# EAGLE schematic MotorController (EAGLE 7.5.0)
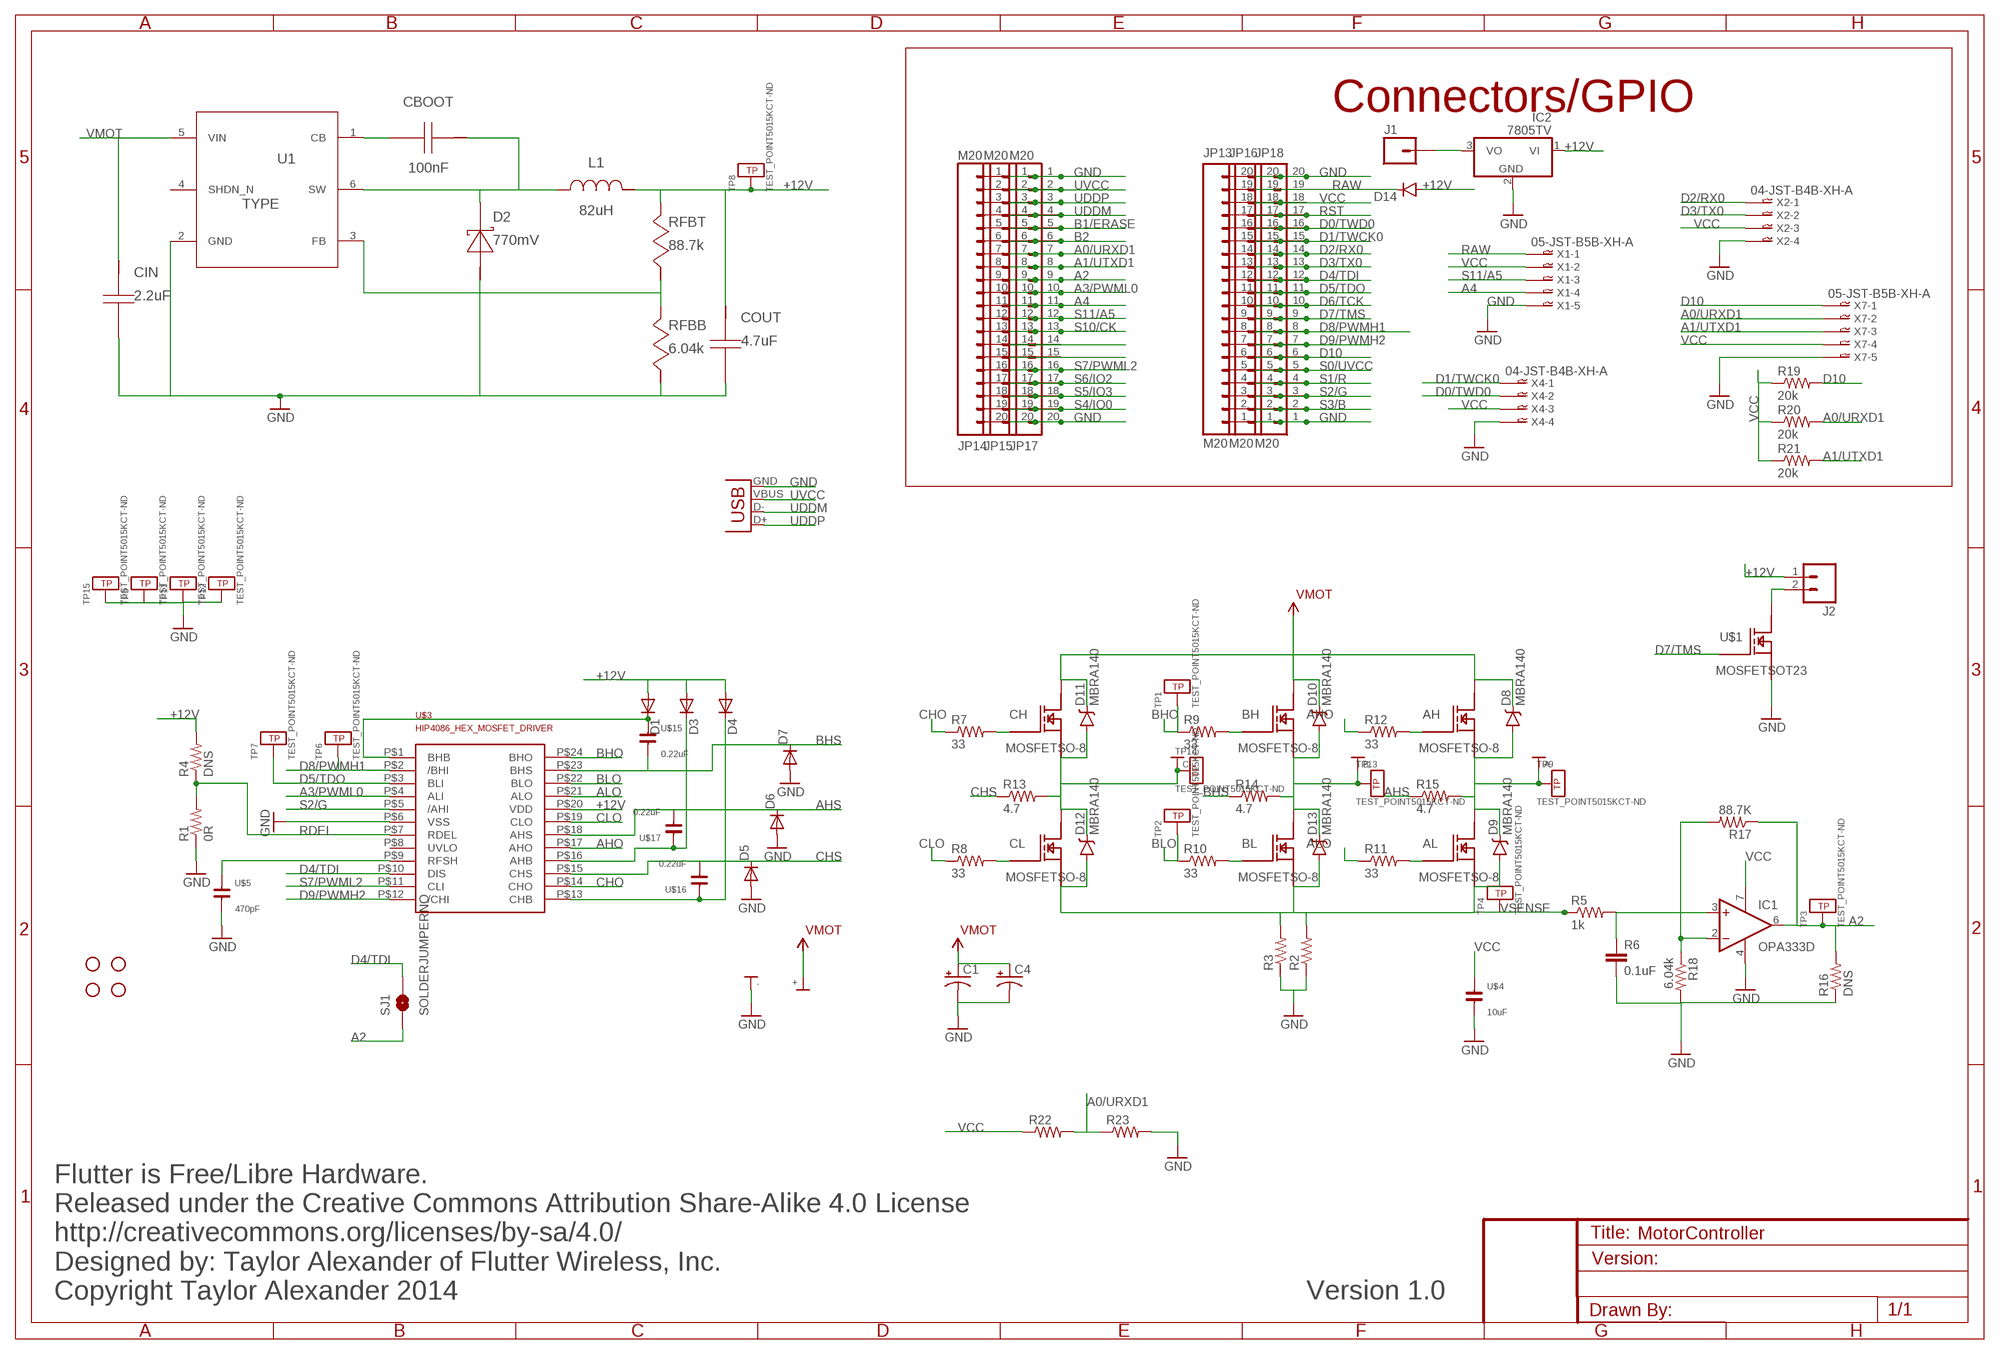
[diagram p0: schematic, sheet 1]

## Parts
+  HIGHCURRENTPAD2  [HIGH_CURRENT_PAD2]
-  HIGHCURRENTPAD2  [HIGH_CURRENT_PAD2]
A  HIGHCURRENTPAD2  [HIGH_CURRENT_PAD2]
AH  MOSFETSO-8  [POWERPAK_S0-8]
AL  MOSFETSO-8  [POWERPAK_S0-8]
B  HIGHCURRENTPAD2  [HIGH_CURRENT_PAD2]
BH  MOSFETSO-8  [POWERPAK_S0-8]
BL  MOSFETSO-8  [POWERPAK_S0-8]
C  HIGHCURRENTPAD2  [HIGH_CURRENT_PAD2]
C1  CAPACITOR-POLARIZED  [CAP-6.5X18MM]
C4  CAPACITOR-POLARIZED  [CAP-6.5X18MM]
CBOOT  100nF  GRM188R72A104KA35D  [0603]
CH  MOSFETSO-8  [POWERPAK_S0-8]
CIN  2.2uF  C3225X7R2A225K230AB  [1210]
CL  MOSFETSO-8  [POWERPAK_S0-8]
COUT  4.7uF  GRM21BR61E475MA12L  [0805]
D1  DIODESMA  [SMA-DIODE]
D2  770mV  DFLS1100-7  [POWERDI123]
D3  DIODESMA  [SMA-DIODE]
D4  DIODESMA  [SMA-DIODE]
D5  DIODESMA  [SMA-DIODE]
D6  DIODESMA  [SMA-DIODE]
D7  DIODESMA  [SMA-DIODE]
D8  MBRA140  DIODE-SCHOTTKY-MBRA140  [SMA-DIODE]
D9  MBRA140  DIODE-SCHOTTKY-MBRA140  [SMA-DIODE]
D10  MBRA140  DIODE-SCHOTTKY-MBRA140  [SMA-DIODE]
D11  MBRA140  DIODE-SCHOTTKY-MBRA140  [SMA-DIODE]
D12  MBRA140  DIODE-SCHOTTKY-MBRA140  [SMA-DIODE]
D13  MBRA140  DIODE-SCHOTTKY-MBRA140  [SMA-DIODE]
D14  DIODESOD123  [SOD-123]
IC1  OPA333D  [SO08]
IC2  7805TV  [TO220V]
J1  M01PTH  [1X01]
J2  M02PTH  [1X02]
JP13  M20  [1X20]
JP14  M20  [1X20]
JP15  M20  [1X20]
JP16  M20  [1X20]
JP17  M20  [1X20]
JP18  M20  [1X20]
L1  82uH  ME3220-823KLB  [ME3220]
R1  0R  RESISTOR0603  [0603-RES]
R2  RESISTOROHMITE  [OHMITE_FCSL64_CURRENT_SENSE_RESISTOR]
R3  RESISTOROHMITE  [OHMITE_FCSL64_CURRENT_SENSE_RESISTOR]
R4  DNS  RESISTOR0603  [0603-RES]
R5  1k  RESISTOR0603  [0603-RES]
R6  0.1uF  CAP0805  [0805]
R7  33  RESISTOR0402  [0402-RES]
R8  33  RESISTOR0402  [0402-RES]
R9  33  RESISTOR0402  [0402-RES]
R10  33  RESISTOR0402  [0402-RES]
R11  33  RESISTOR0402  [0402-RES]
R12  33  RESISTOR0402  [0402-RES]
R13  4.7  RESISTOR0402  [0402-RES]
R14  4.7  RESISTOR0402  [0402-RES]
R15  4.7  RESISTOR0402  [0402-RES]
R16  DNS  RESISTOR0402  [0402-RES]
R17  88.7K  RESISTOR0402  [0402-RES]
R18  6.04k  RESISTOR0402  [0402-RES]
R19  20k  RESISTOR0402  [0402-RES]
R20  20k  RESISTOR0402  [0402-RES]
R21  20k  RESISTOR0402  [0402-RES]
R22  RESISTOR0603  [0603-RES]
R23  RESISTOR0603  [0603-RES]
RFBB  6.04k  CRCW04026K04FKED  [0402]
RFBT  88.7k  CRCW040288K7FKED  [0402]
SJ1  SOLDERJUMPERNO  [SJ_2S-NO]
STANDOFF1  STAND-OFF  [STAND-OFF]
STANDOFF2  STAND-OFF  [STAND-OFF]
STANDOFF3  STAND-OFF  [STAND-OFF]
STANDOFF4  STAND-OFF  [STAND-OFF]
TP1  TEST_POINT5015KCT-ND  [TEST_POINT_SMT_KEYSTONE_5015]
TP2  TEST_POINT5015KCT-ND  [TEST_POINT_SMT_KEYSTONE_5015]
TP3  TEST_POINT5015KCT-ND  [TEST_POINT_SMT_KEYSTONE_5015]
TP4  TEST_POINT5015KCT-ND  [TEST_POINT_SMT_KEYSTONE_5015]
TP5  TEST_POINT5015KCT-ND  [TEST_POINT_SMT_KEYSTONE_5015]
TP6  TEST_POINT5015KCT-ND  [TEST_POINT_SMT_KEYSTONE_5015]
TP7  TEST_POINT5015KCT-ND  [TEST_POINT_SMT_KEYSTONE_5015]
TP8  TEST_POINT5015KCT-ND  [TEST_POINT_SMT_KEYSTONE_5015]
TP9  TEST_POINT5015KCT-ND  [TEST_POINT_SMT_KEYSTONE_5015]
TP11  TEST_POINT5015KCT-ND  [TEST_POINT_SMT_KEYSTONE_5015]
TP12  TEST_POINT5015KCT-ND  [TEST_POINT_SMT_KEYSTONE_5015]
TP13  TEST_POINT5015KCT-ND  [TEST_POINT_SMT_KEYSTONE_5015]
TP14  TEST_POINT5015KCT-ND  [TEST_POINT_SMT_KEYSTONE_5015]
TP15  TEST_POINT5015KCT-ND  [TEST_POINT_SMT_KEYSTONE_5015]
U1  Value  LMR16006YDDCR  [DDC0006A]
U$1  MOSFETSOT23  [SOT23]
U$3  HIP4086_HEX_MOSFET_DRIVER  [SOIC-24]
U$4  10uF  CAPACITOR0805  [0808-CAP]
U$5  470pF  CAPACITOR0603-CAP  [0603-CAP]
U$15  0.22uF  CAPACITOR0805  [0808-CAP]
U$16  0.22uF  CAPACITOR0805  [0808-CAP]
U$17  0.22uF  CAPACITOR0805  [0808-CAP]
X1  05-JST-B5B-XH-A  [B5B-XH]
X2  04-JST-B4B-XH-A  [B4B-XH]
X4  04-JST-B4B-XH-A  [B4B-XH]
X5  USBPTH  [USB-B-PTH]
X7  05-JST-B5B-XH-A  [B5B-XH]

## Nets
2: RFBB.1 RFBT.2 U1.3(FB)
3: CBOOT.1 D2.1(K) L1.1 U1.6(SW)
5: CBOOT.2 U1.1(CB)
+12V: COUT.1 D1.A D3.A D4.A D14.A IC2.1(VI) J2.1 L1.2 R4.2 RFBT.1 TP8.P$1 U$3.P$20(VDD)
A: A.P$1 AH.S@1(S) AH.S@2(S) AH.S@3(S) AL.D@1(D) AL.DTOP(D) D8.A D9.C R15.2 TP9.P$1
A0/URXD1: JP14.7 JP15.7 JP17.7 R20.2 R22.2 R23.1 X7.P$2
A1/UTXD1: JP14.8 JP15.8 JP17.8 R21.2 X7.P$3
A2: IC1.6(OUT) JP14.9 JP15.9 JP17.9 R16.2 R17.1 SJ1.1 TP3.P$1
A3/PWML0: JP14.10 JP15.10 JP17.10 U$3.P$4(ALI)
A4: JP14.11 JP15.11 JP17.11 X1.P$4
AHB: D3.C U$3.P$16(AHB) U$17.1
AHO: R12.1 U$3.P$17(AHO)
AHS: D6.C R15.1 U$3.P$18(AHS) U$17.2
ALO: R11.1 U$3.P$21(ALO)
B: B.P$1 BH.S@1(S) BH.S@2(S) BH.S@3(S) BL.D@1(D) BL.DTOP(D) D10.A D13.C R14.2 TP13.P$1
B1/ERASE: JP14.5 JP15.5 JP17.5
B2: JP14.6 JP15.6 JP17.6
BHO: R9.1 TP1.P$1 U$3.P$24(BHO)
BHS: D7.C R14.1 U$3.P$23(BHS) U$15.2
BLO: R10.1 TP2.P$1 U$3.P$22(BLO)
C: C.P$1 CH.S@1(S) CH.S@2(S) CH.S@3(S) CL.D@1(D) CL.DTOP(D) D11.A D12.C R13.2 TP14.P$1
CHB: D4.C U$3.P$13(CHB) U$16.1
CHO: R7.1 U$3.P$14(CHO)
CHS: D5.C R13.1 U$3.P$15(CHS) U$16.2
CLO: R8.1 U$3.P$19(CLO)
D0/TWD0: JP13.16 JP16.16 JP18.16 X4.P$2
D1/TWCK0: JP13.15 JP16.15 JP18.15 X4.P$1
D2/RX0: JP13.14 JP16.14 JP18.14 X2.P$1
D3/TX0: JP13.13 JP16.13 JP18.13 X2.P$2
D4/TDI: JP13.12 JP16.12 JP18.12 SJ1.2 U$3.P$10(DIS)
D5/TDO: JP13.11 JP16.11 JP18.11 TP7.P$1 U$3.P$3(BLI)
D6/TCK: JP13.10 JP16.10 JP18.10
D7/TMS: JP13.9 JP16.9 JP18.9 U$1.1(G)
D8/PWMH1: JP13.8 JP16.8 JP18.8 TP6.P$1 U$3.P$2(/BHI)
D9/PWMH2: JP13.7 JP16.7 JP18.7 U$3.P$12(/CHI)
D10: JP13.6 JP16.6 JP18.6 R19.2 X7.P$1
GND [Power]: -.P$1 C1.- C4.- CIN.2 COUT.2 D2.2(A) D5.A D6.A D7.A IC1.4(V-) IC2.2(GND) JP13.1 JP13.20 JP14.1 JP14.20 JP15.1 JP15.20 JP16.1 JP16.20 JP17.1 JP17.20 JP18.1 JP18.20 R1.1 R2.P$1 R3.P$1 R6.2 R16.1 R18.2 R23.2 RFBB.2 TP5.P$1 TP11.P$1 TP12.P$1 TP15.P$1 U1.2(GND) U$1.2(S) U$3.P$6(VSS) U$4.2 U$5.2 X1.P$5 X2.P$4 X4.P$4 X5.GND X7.P$5
N$1: U$3.P$9(RFSH) U$5.1
N$2: IC1.2(-IN) R17.2 R18.1
N$3: IC1.3(+IN) R5.2 R6.1
N$4: IC2.3(VO) J1.1
N$5: JP14.14 JP15.14 JP17.14
N$6: JP14.15 JP15.15 JP17.15
N$7: CH.G R7.2
N$8: CL.G R8.2
N$10: J2.2 U$1.3(D)
N$11: BH.G R9.2
N$13: BL.G R10.2
N$14: AL.G R11.2
N$15: AH.G R12.2
N$19: D1.C U$3.P$1(BHB) U$15.1
RAW: D14.C JP13.19 JP16.19 JP18.19 X1.P$1
RDEL: R1.2 R4.1 U$3.P$7(RDEL)
RST: JP13.17 JP16.17 JP18.17
S0/UVCC: JP13.5 JP16.5 JP18.5
S1/R: JP13.4 JP16.4 JP18.4
S2/G: JP13.3 JP16.3 JP18.3 U$3.P$5(/AHI)
S3/B: JP13.2 JP16.2 JP18.2
S4/IO0: JP14.19 JP15.19 JP17.19
S5/IO3: JP14.18 JP15.18 JP17.18
S6/IO2: JP14.17 JP15.17 JP17.17
S7/PWML2: JP14.16 JP15.16 JP17.16 U$3.P$11(CLI)
S10/CK: JP14.13 JP15.13 JP17.13
S11/A5: JP14.12 JP15.12 JP17.12 X1.P$3
UDDM: JP14.4 JP15.4 JP17.4 X5.D-
UDDP: JP14.3 JP15.3 JP17.3 X5.D+
UVCC: JP14.2 JP15.2 JP17.2 X5.VBUS
VCC: IC1.7(V+) JP13.18 JP16.18 JP18.18 R19.1 R20.1 R21.1 R22.1 U$4.1 X1.P$2 X2.P$3 X4.P$3 X7.P$4
VMOT: +.P$1 AH.D@1(D) AH.DTOP(D) BH.D@1(D) BH.DTOP(D) C1.+ C4.+ CH.D@1(D) CH.DTOP(D) CIN.1 D8.C D10.C D11.C U1.5(VIN)
VSENSE: AL.S@1(S) AL.S@2(S) AL.S@3(S) BL.S@1(S) BL.S@2(S) BL.S@3(S) CL.S@1(S) CL.S@2(S) CL.S@3(S) D9.A D12.A D13.A R2.P$2 R3.P$2 R5.1 TP4.P$1
Unconnected: U1.4(SHDN_N) U$3.P$8(UVLO)

## Notes on the sheet
- Connectors/GPIO
- Flutter is Free/Libre Hardware.
  Released under the Creative Commons Attribution Share-Alike 4.0 License
  http://creativecommons.org/licenses/by-sa/4.0/
  Designed by: Taylor Alexander of Flutter Wireless, Inc.
  Copyright Taylor Alexander 2014
- Version 1.0

## Library data of the parts
+ - A B C = Taylor:HIGHCURRENTPAD2
AH AL BH BL CH CL U$1 = Taylor:MOSFET
C1 C4 = Taylor:CAPACITOR-POLARIZED
CBOOT = AcceleratedDesigns:GRM188R72A104KA35D; CAP: 1.0E-7; ESR: 0.0; IRMS: 0.0; MANUFACTURER_NAME: MuRata; MANUFACTURER_PART_NUMBER: GRM188R72A104KA35D; VDC: 100.0; VENDOR: MuRata
CIN = AcceleratedDesigns:C3225X7R2A225K230AB; CAP: 2.2E-6; DATASHEETURL: http://product.tdk.com/capacitor/mlcc/en/documents/mlcc%5Fcommercial%5Fmidvoltage%5Fen.pdf; ESR: 0.0028; IRMS: 9.824718; MANUFACTURER_NAME: TDK; MANUFACTURER_PART_NUMBER: C3225X7R2A225K230AB; VDC: 100.0; VENDOR: TDK
COUT = AcceleratedDesigns:GRM21BR61E475MA12L; CAP: 4.7E-6; DATASHEETURL: http://www.murata.com/products/catalog/pdf/c02e.pdf; ESR: 0.0020; IRMS: 7.29; MANUFACTURER_NAME: MuRata; MANUFACTURER_PART_NUMBER: GRM21BR61E475MA12L; VDC: 25.0; VENDOR: MuRata
D1 D3-D7 = SparkFun:DIODE: Diode These are standard reverse protection diodes and small signal diodes. SMA package can handle up to about 1A. SOD-323 can handle about 200mA. What the SOD-323 package when ordering, there are some mfgs out there that are 5-pin packages.
D2 = AcceleratedDesigns:DFLS1100-7; DATASHEETURL: http://www.diodes.com/datasheets/ds30497.pdf; IO: 1.0; MANUFACTURER_NAME: Diodes Inc.; MANUFACTURER_PART_NUMBER: DFLS1100-7; VENDOR: Diodes Inc.; VFATIO: 0.77; VRRM: 100.0
D8-D13 = SparkFun-DiscreteSemi:DIODE-SCHOTTKY: Schottky diodes in SFE's production catalog BAT20J 1A 23V 0.62Vf RB751 120mA 40V 0.37Vf PMEG4005EJ 0.5A 40V 0.42Vf MBRA140 1A 40V 0.5Vf B340A 3A 40V SMA; PROD_ID: DIO-08053
D14 = SparkFun-DiscreteSemi:DIODE: Diode These are standard reverse protection diodes and small signal diodes. SMA package can handle up to about 1A. SOD-323 can handle about 200mA. What the SOD-323 package when ordering, there are some mfgs out there that are 5-pin packages.
IC1 = linear:OPA333: 1.8V, microPOWER CMOS OPERATIONAL AMPLIFIERS Zerø-Drift Series Source: Texas Instruments (Burr-Brown) .. U11 opa333 Operational Amp.pdf
IC2 = linear:78*: Positive VOLTAGE REGULATOR Source: http://cache.national.com/ds/LM/LM78L05.pdf http://www.fairchildsemi.com/ds/LM/LM7805.pdf
J1 = SparkFun-Connectors:M01: Header 1 Standard 1-pin 0.1" header. Use with straight break away headers (SKU : PRT-00116), right angle break away headers (PRT-00553), swiss pins (PRT-00743), machine pins (PRT-00117), and female headers (PRT-00115). SMTSO-256-ET is a "flush mount" nut for a 4-40 screw. The older package used to be too tight, and did not allow it to sit properly thru the drill hit. The latest (0.165DIA) fits nice and snug.
J2 = SparkFun-Connectors:M02: Standard 2-pin 0.1" header. Use with - straight break away headers ( PRT-00116) - right angle break away headers (PRT-00553) - swiss pins (PRT-00743) - machine pins (PRT-00117) - female headers (PRT-00115) Molex polarized connector foot print use with: PRT-08233 with associated crimp pins and housings. 2.54_SCREWTERM for use with PRT-10571. 3.5mm Screw Terminal footprints for PRT-08084 5mm Screw Terminal footprints for use with PRT-08432
JP13-JP18 = SparkFun:M20: This is just like the LOCK variant in that the holes are staggared by 5 mil, but except for the last two holes. They are not altered from the "standard" footprint layout. This is used for a special purpose on the layout of our Graphic LCD Backpack. Make sure you want to use this device before selecting it for you project!
L1 = AcceleratedDesigns:ME3220-823KLB; DCR: 3.0; IDC: 0.34; L: 8.2E-5; MANUFACTURER_NAME: Coilcraft; MANUFACTURER_PART_NUMBER: ME3220-823KLB; VENDOR: Coilcraft
R1-R5 R7-R23 = Taylor:RESISTOR: Resistor Basic schematic elements and footprints for 0603, 1206, and PTH 1/10th watt (small) resistors.
R6 = SparkFun-Capacitors:CAP: Capacitor Standard 0603 ceramic capacitor, and 0.1" leaded capacitor.
RFBB = AcceleratedDesigns:CRCW04026K04FKED; MANUFACTURER_NAME: Vishay-Dale; MANUFACTURER_PART_NUMBER: CRCW04026K04FKED; POWER: 0.063; RESISTANCE: 6040.0; TOLERANCE: 1.0; VENDOR: Vishay-Dale
RFBT = AcceleratedDesigns:CRCW040288K7FKED; MANUFACTURER_NAME: Vishay-Dale; MANUFACTURER_PART_NUMBER: CRCW040288K7FKED; POWER: 0.063; RESISTANCE: 88700.0; TOLERANCE: 1.0; VENDOR: Vishay-Dale
SJ1 = SparkFun-Retired:SOLDERJUMPER: Solder Jumper Standard SMD solder jumper. Used to automate production. Two varients : Normally Open and Normally Closed are the same, but have different paste layers. NC will have a large amount of paste and should jumper during reflow.
STANDOFF1-STANDOFF4 = SparkFun-Electromechanical:STAND-OFF: #4 Stand Off This is the mechanical footprint for a #4 phillips button head screw. Use the keepout ring to avoid running the screw head into surrounding components. SKU : PRT-00447
TP1-TP9 TP11-TP15 = Taylor:TEST_POINT: Test Points. First one is Keystone 5015 part. Dkey # 5015KCT-ND
U1 = AcceleratedDesigns:LMR16006YDDCR; COMPTYPE: IC; MANUFACTURER: Texas Instruments; MANUFACTURER_NAME: Texas Instruments; MANUFACTURER_PART_NUMBER: LMR16006YDDCR; MOUNTTYPE: SMT; PACKAGEREFERENCE: DDC0006A; PARTNUMBER: LMR16006YDDC; PIN_COUNT: 6; REFDES: RefDes; ROHS: Y; TYPE: TYPE
U$3 = Taylor:HIP4086_HEX_MOSFET_DRIVER
U$4 U$5 U$15-U$17 = Taylor:CAPACITOR
X1 X7 = con-jst-xh:05-JST: JST CONNECTOR
X2 X4 = con-jst-xh:04-JST: JST CONNECTOR
X5 = SparkFun:USB: USB Connectors USB-B-PTH is fully proven SKU : PRT-00139 USB-miniB is fully proven SKU : PRT-00587 USB-A-PCB is untested. USB-A-H is throughly reviewed, but untested. Spark Fun Electronics SKU : PRT-00437 USB-B-SMT is throughly reviewed, but untested. Needs silkscreen touching up. USB-A-S has not been used/tested USB-MB-H has not been used/tested

## Net classes
0 default: width 0.152 mm, drill 0.152 mm, clearance 0.102 mm
1 Power: width 0.203 mm, drill 0.152 mm, clearance 0.102 mm